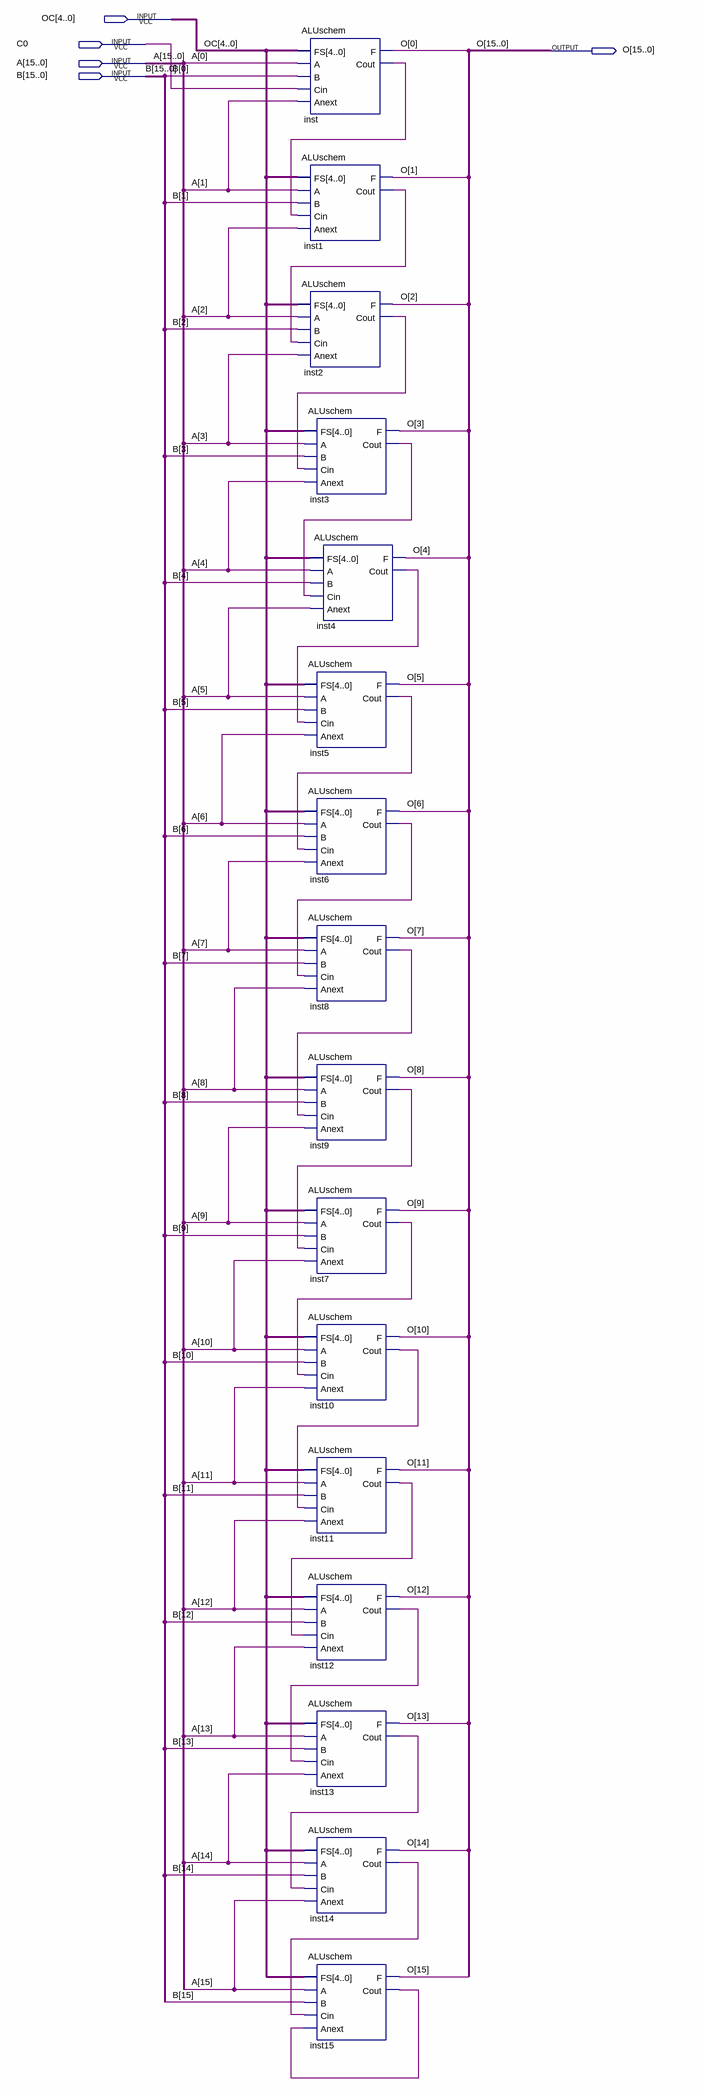
[diagram p0: schematic sheet]
// Quartus schematic ALUschemfull.bdf as structural Verilog: 16 symbols, 5 pins
module ALUschemfull (
  input  [4:0] OC,
  input  C0,
  input  [15:0] A,
  input  [15:0] B,
  output [15:0] O
);

  wire inst1_cout, inst2_cout, inst3_cout, inst4_cout, inst5_cout, inst6_cout, inst7_cout, inst8_cout,
       inst9_cout, inst10_cout, inst11_cout, inst12_cout, inst13_cout, inst14_cout, inst15_cout, inst_cout;

  ALUschem inst (.FS(OC), .A(A[0]), .B(B[0]), .Cin(C0), .Anext(A[1]), .F(O[0]), .Cout(inst_cout));
  ALUschem inst1 (.FS(OC), .A(A[1]), .B(B[1]), .Cin(inst_cout), .Anext(A[2]), .F(O[1]), .Cout(inst1_cout));
  ALUschem inst2 (.FS(OC), .A(A[2]), .B(B[2]), .Cin(inst1_cout), .Anext(A[3]), .F(O[2]), .Cout(inst2_cout));
  ALUschem inst3 (.FS(OC), .A(A[3]), .B(B[3]), .Cin(inst2_cout), .Anext(A[4]), .F(O[3]), .Cout(inst3_cout));
  ALUschem inst4 (.FS(OC), .A(A[4]), .B(B[4]), .Cin(inst3_cout), .Anext(A[5]), .F(O[4]), .Cout(inst4_cout));
  ALUschem inst5 (.FS(OC), .A(A[5]), .B(B[5]), .Cin(inst4_cout), .Anext(A[6]), .F(O[5]), .Cout(inst5_cout));
  ALUschem inst6 (.FS(OC), .A(A[6]), .B(B[6]), .Cin(inst5_cout), .Anext(A[7]), .F(O[6]), .Cout(inst6_cout));
  ALUschem inst8 (.FS(OC), .A(A[7]), .B(B[7]), .Cin(inst6_cout), .Anext(A[8]), .F(O[7]), .Cout(inst8_cout));
  ALUschem inst9 (.FS(OC), .A(A[8]), .B(B[8]), .Cin(inst8_cout), .Anext(A[9]), .F(O[8]), .Cout(inst9_cout));
  ALUschem inst7 (.FS(OC), .A(A[9]), .B(B[9]), .Cin(inst9_cout), .Anext(A[10]), .F(O[9]), .Cout(inst7_cout));
  ALUschem inst10 (.FS(OC), .A(A[10]), .B(B[10]), .Cin(inst7_cout), .Anext(A[11]), .F(O[10]), .Cout(inst10_cout));
  ALUschem inst11 (.FS(OC), .A(A[11]), .B(B[11]), .Cin(inst10_cout), .Anext(A[12]), .F(O[11]), .Cout(inst11_cout));
  ALUschem inst12 (.FS(OC), .A(A[12]), .B(B[12]), .Cin(inst11_cout), .Anext(A[13]), .F(O[12]), .Cout(inst12_cout));
  ALUschem inst13 (.FS(OC), .A(A[13]), .B(B[13]), .Cin(inst12_cout), .Anext(A[14]), .F(O[13]), .Cout(inst13_cout));
  ALUschem inst14 (.FS(OC), .A(A[14]), .B(B[14]), .Cin(inst13_cout), .Anext(A[15]), .F(O[14]), .Cout(inst14_cout));
  ALUschem inst15 (
    .FS(OC), .A(A[15]), .B(B[15]), .Cin(inst14_cout), .Anext(inst15_cout), .F(O[15]), .Cout(inst15_cout));
endmodule
